# Altium schematic sheet Connectors and PDB.SchDoc: Connectors and PDB
size Letter; DrawnBy: Kyle Hong; SheetNumber: 2; SheetTotal: 2
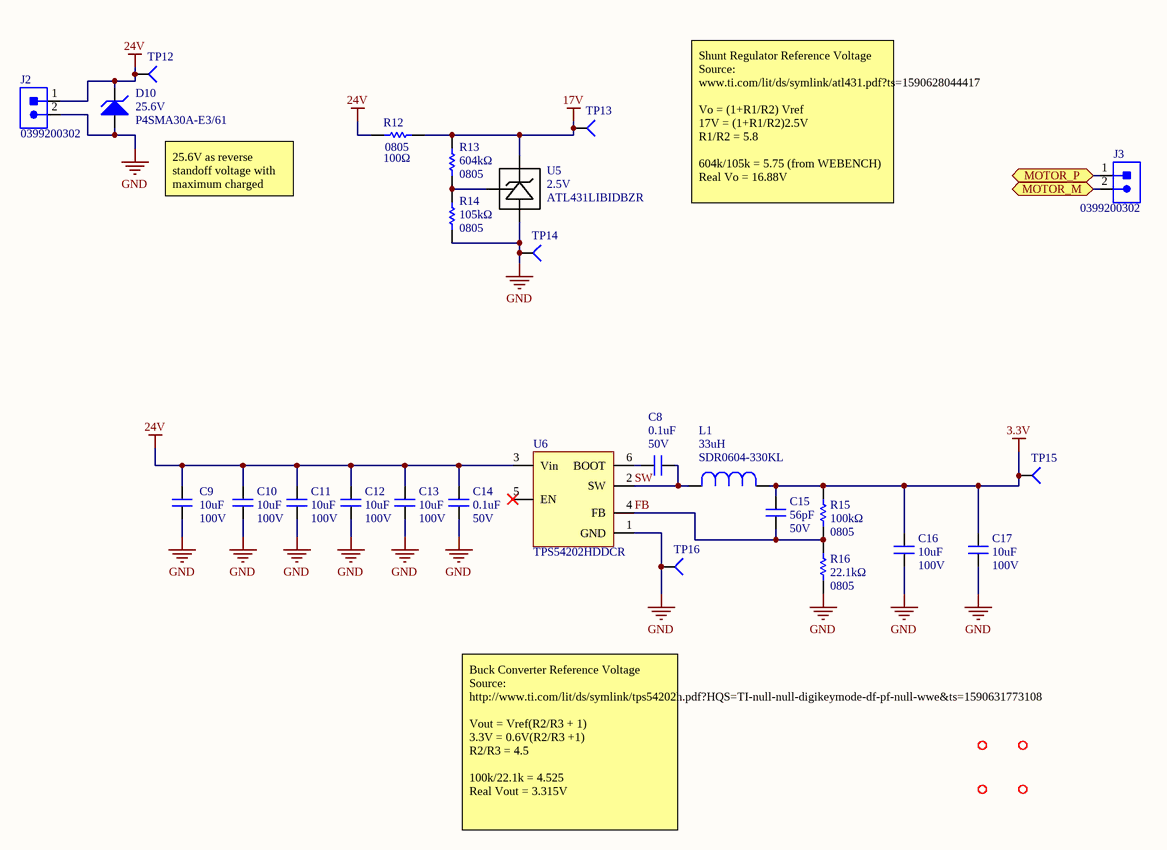
[diagram p0: Connectors and PDB.SchDoc]

## Parts
C8  value 0.1uF  Voltage Rating: 50V  [CAPC2012X140N]  (hidden comment: CAP_0.1uF_50V_0805)
C9  Capacitance: 10uF  Voltage Rating: 100V  [CAPC1210(3225)]  (hidden comment: CAP_10uF_100V_1210)
C10  Capacitance: 10uF  Voltage Rating: 100V  [CAPC1210(3225)]  (hidden comment: CAP_10uF_100V_1210)
C11  Capacitance: 10uF  Voltage Rating: 100V  [CAPC1210(3225)]  (hidden comment: CAP_10uF_100V_1210)
C12  Voltage Rating: 100V  Capacitance: 10uF  [CAPC1210(3225)]  (hidden comment: CAP_10uF_100V_1210)
C13  Voltage Rating: 100V  Capacitance: 10uF  [CAPC1210(3225)]  (hidden comment: CAP_10uF_100V_1210)
C14  value 0.1uF  Voltage Rating: 50V  [CAPC2012X140N]  (hidden comment: CAP_0.1uF_50V_0805)
C15  Voltage Rating: 50V  Capacitance: 56pF  [CAP 0805_2012]  (hidden comment: CAP_56pF_50V_0805)
C16  Capacitance: 10uF  Voltage Rating: 100V  [CAPC1210(3225)]  (hidden comment: CAP_10uF_100V_1210)
C17  Capacitance: 10uF  Voltage Rating: 100V  [CAPC1210(3225)]  (hidden comment: CAP_10uF_100V_1210)
D10  Reverse Standoff Voltage: 25.6V  [DO-214AC_UNI]  (hidden comment: P4SMA30A-E3/61)
J2  Manufacturer Part Number 1: 0399200302  [MOLEX-0399200302]  (hidden comment: SCREW_TERM_115A)
J3  Manufacturer Part Number 1: 0399200302  [MOLEX-0399200302]  (hidden comment: SCREW_TERM_115A)
L1  Manufacturer Part Number 1: SDR0604-330KL  Inductance: 33uH  [IND_BOURNS_SDR0604]  (hidden comment: IND_33uH_880mA)
MH1  MOUNTING_HOLES  [MOUNTING_HOLE]  (value not drawn)
MH2  MOUNTING_HOLES  [MOUNTING_HOLE]  (value not drawn)
MH3  MOUNTING_HOLES  [MOUNTING_HOLE]  (value not drawn)
MH4  MOUNTING_HOLES  [MOUNTING_HOLE]  (value not drawn)
R12  value 100Ω  Case Code (Imperial): 0805  [RESC2012X60N]  (hidden comment: RES_100Ω_0805)
R13  Resistance: 604kΩ  Case/Package: 0805  [RESC2012X60N]  (hidden comment: RES_604kΩ_0805)
R14  Resistance: 105kΩ  Case Code (Imperial): 0805  [RESC2012X60N]  (hidden comment: RES_105kΩ_0805)
R15  Resistance: 100kΩ  Case/Package: 0805  [RESC2012X60N]  (hidden comment: RES_100kΩ_0805)
R16  Case Code (Imperial): 0805  Resistance: 22.1kΩ  [RESC2012X60N]  (hidden comment: RES_22.1kΩ_0805)
TP12  TESTPOINT_SMD  [TESTPOINT]  (value not drawn)
TP13  TESTPOINT_SMD  [TESTPOINT]  (value not drawn)
TP14  TESTPOINT_SMD  [TESTPOINT]  (value not drawn)
TP15  TESTPOINT_SMD  [TESTPOINT]  (value not drawn)
TP16  TESTPOINT_SMD  [TESTPOINT]  (value not drawn)
U5  Reference Voltage: 2.5V  [SOT23-3]  (hidden comment: ATL431LIBIDBZR)
U6  TPS54202HDDCR  [SOT23-6]

## Ports
MOTOR_M (bidir), MOTOR_P (bidir)

## Nets
3.3V: C15.2 C16.2 C17.2 L1.1 R15.2 TP15.1(=value)
17V: R12.2 R13.2 TP13.1(=value) U5.1(CATHODE)
24V: C9.2 C10.2 C11.2 C12.2 C13.2 C14.2 D10.2 J2.1 R12.1 TP12.1(=value) U6.3(Vin)
GND: C9.1 C10.1 C11.1 C12.1 C13.1 C14.1 C16.1 C17.1 D10.1 J2.2 R14.1 R16.1 TP14.1(=value) TP16.1(=value) U5.3(ANODE) U6.1(GND)
FB: C15.1 R15.1 R16.2 U6.4(FB)
MOTOR_M: J3.2 ; port MOTOR_M
MOTOR_P: J3.1 ; port MOTOR_P
SW: C8.2 L1.2 U6.2(SW)
NetC8_1: C8.1 U6.6(BOOT)
NetR13_1: R13.1 R14.2 U5.2(REF)

Not connected (* = marked no-connect by the designer): U6 5(EN)*

## Notes on the sheet
- 25.6V as reverse standoff voltage with maximum charged condition in mind
- Shunt Regulator Reference Voltage
  Source: www.ti.com/lit/ds/symlink/atl431.pdf?ts=1590628044417
  Vo = (1+R1/R2) Vref
  17V = (1+R1/R2)2.5V
  R1/R2 = 5.8
  604k/105k = 5.75 (from WEBENCH)
  Real Vo = 16.88V
- Buck Converter Reference Voltage
  Source: http://www.ti.com/lit/ds/symlink/tps54202h.pdf?HQS=TI-null-null-digikeymode-df-pf-null-wwe&ts=1590631773108
  Vout = Vref(R2/R3 + 1)
  3.3V = 0.6V(R2/R3 +1)
  R2/R3 = 4.5
  100k/22.1k = 4.525
  Real Vout = 3.315V
- Title
- Size:
- Date:
- Letter
- Drawn By:
- Sheet
- of
- File:

## Library data of the parts
C8 C14 = CAP_0.1uF_50V_0805: CAP CER 0.1UF 50V X7R 0805; Manufacturer 1: Murata Electronics; Manufacturer Part Number 1: GCD21BR71H104KA01L; Capacitance: 100nF; Tolerance: 10%; Mount: Surface Mount; Case/Package: 0805; Case Code (Metric): 2012; Case Code (Imperial): 0805; Min Operating Temperature: -55°C; Max Operating Temperature: 125°C; Dielectric: X7R; Termination: SMD/SMT; Length: 2mm; Height: 1.25mm; Width: 0.049inch; Thickness: 0.049inch; Depth: 1.25mm; Ratings: AEC-Q200; ComponentLink1URL: https://datasheet.ciiva.com/29537/c03e-29537701.pdf?src-supplier=Digi-Key; ComponentLink1Description: https://datasheet.ciiva.com/29537/c03e-29537701.pdf?src-supplier=Digi-Key; Supplier 1: Digi-Key; Supplier Part Number 1: 490-11955-1-ND
C9-C13 C16 C17 = CAP_10uF_100V_1210: CAP CER 10uF 100V X7S 10% 1210; Manufacturer 1: Murata; Manufacturer Part Number 1: GRM32EC72A106KE05L; Supplier 1: Digi-Key; RoHS: No; Category: Ceramic Capacitors; Stock 1: 5650; Pricing 1: 1=1.51000, 10=1.19500, 100=0.89660, 500=0.67740 (USD); Mount: Surface Mount; Case/Package: 1210; Case Code (Imperial): 1210; Case Code (Metric): 3225; Min Operating Temperature: -55°C; Max Operating Temperature: 125°C; Packaging: Tape and Reel; Tolerance: 10%; ComponentLink1URL: https://psearch.en.murata.com:443/capacitor/product/GRM32EC72A106KE05%23.pdf?src-supplier=IHS+Markit; ComponentLink1Description: https://psearch.en.murata.com:443/capacitor/product/GRM32EC72A106KE05%23.pdf?src-supplier=IHS+Markit; ComponentLink2URL: http://search.murata.co.jp/Ceramy/image/img/A01X/G101/ENG/GRM32EC72A106KE05-01.pdf?src-supplier=Digi-Key; ComponentLink2Description: http://search.murata.co.jp/Ceramy/image/img/A01X/G101/ENG/GRM32EC72A106KE05-01.pdf?src-supplier=Digi-Key; Supplier Part Number 1: 490-16266-1-ND
C15 = CAP_56pF_50V_0805: CAP CER 56PF 50V C0G/NP0; Manufacturer 1: Yageo; Manufacturer Part Number 1: CC0805FRNPO9BN560; Dielectric: C0G; Tolerance: 1%; Supplier 1: Digi-Key; RoHS: Yes; Category: Ceramic Capacitors; Stock 1: 3302; Pricing 1: 1=0.28000, 10=0.19000, 100=0.10740, 500=0.07582, 1000=0.06634 (USD); Mount: Surface Mount; Case/Package: 0805; Weight: 0.000194oz; Case Code (Metric): 2012; Case Code (Imperial): 0805; Min Operating Temperature: -55°C; Max Operating Temperature: 125°C; Termination: SMD/SMT; Composition: Ceramic; Packaging: Tape and Reel; Voltage Rating (DC): 50V; Length: 2mm; Height: 0.6mm; Depth: 1.25mm; Width: 0.049inch; Thickness: 0.028inch; Radiation Hardening: No; ComponentLink1URL: https://datasheet.ciiva.com:443/pdfs/VipMasterIC/IC/YAGO/YAGO-S-A0009251638/YAGO-S-A0009251638-1.pdf?src-supplier=IHS+Markit; ComponentLink1Description: https://datasheet.ciiva.com:443/pdfs/VipMasterIC/IC/YAGO/YAGO-S-A0009251638/YAGO-S-A0009251638-1.pdf?src-supplier=IHS+Markit; ComponentLink2URL: https://datasheet.ciiva.com/26918/getdatasheetpartid-251796-26918325.pdf?src-supplier=Verical; ComponentLink2Description: https://datasheet.ciiva.com/26918/getdatasheetpartid-251796-26918325.pdf?src-supplier=Verical; ComponentLink3URL: https://datasheet.ciiva.com/11465/upy-gp-np0-16v-to-50v-8-11465142.pdf?src-supplier=Avnet; ComponentLink3Description: https://datasheet.ciiva.com/11465/upy-gp-np0-16v-to-50v-8-11465142.pdf?src-supplier=Avnet; ComponentLink4URL: https://datasheet.ciiva.com/17436/upy-gp-np0-16v-to-50v-8-17436825.pdf?src-supplier=Avnet+Europe; ComponentLink4Description: https://datasheet.ciiva.com/17436/upy-gp-np0-16v-to-50v-8-17436825.pdf?src-supplier=Avnet+Europe; Supplier Part Number 1: 311-4179-1-ND
D10 = P4SMA30A-E3/61: TVS DIODE, 400W, 25.6V, UNI, DO-214AC; Manufacturer 1: Vishay Semiconductors; Element Configuration: Single; Leakage Current: 1uA; Direction: Unidirectional; Reverse Breakdown Voltage: 28.5V; Max Surge Current: 40A; Number of Unidirectional Channels: 1; Clamping Voltage: 41.4V; Power Line Protection: No; Test Current: 1mA; Peak Pulse Current: 9.7A; Supplier 1: Digi-Key; RoHS: Yes; Category: TVS Diodes; Stock 1: 1849; Pricing 1: 1=0.35000, 10=0.28400, 25=0.26000, 100=0.16340, 250=0.16152, 500=0.15126 (USD); Mount: Surface Mount; Case/Package: SMA; Number of Pins: 2; Min Operating Temperature: -65°C; Max Operating Temperature: 150°C; Max Power Dissipation: 400W; Composition: Zener; Packaging: Tape and Reel; Package Quantity: 1800; Operating Supply Voltage: 25.6V; Polarity: Unidirectional; Min Breakdown Voltage: 28.5V; Peak Pulse Power: 400W; Breakdown Voltage: 28.5V; Number of Channels: 1; Max Reverse Leakage Current: 1uA; Number of Elements: 1; ComponentLink1URL: https://datasheet.ciiva.com:443/pdfs/VipMasterIC/IC/VISH/VISH-S-A0008073361/VISH-S-A0008073361-1.pdf?src-supplier=IHS+Markit; ComponentLink1Description: https://datasheet.ciiva.com:443/pdfs/VipMasterIC/IC/VISH/VISH-S-A0008073361/VISH-S-A0008073361-1.pdf?src-supplier=IHS+Markit; ComponentLink2URL: https://datasheet.ciiva.com/343/p4sma-343073.pdf?src-supplier=Digi-Key; ComponentLink2Description: https://datasheet.ciiva.com/343/p4sma-343073.pdf?src-supplier=Digi-Key; Supplier Part Number 1: P4SMA30A-E3/61GICT-ND; Manufacturer Part Number 1: P4SMA30A-E3/61
J2 J3 = SCREW_TERM_115A: CONN TERM BLOCK 2POS 15MM 1-8AWG; Manufacturer 1: Molex; Plating: Brass,Bronze,Tin; Number of Levels: 1; Number of Positions Per Level: 2; Current: 115A; Voltage: 600V; Pitch: 0.591inch; Wire Gauge (Max): 8AWG; Wire Gauge (Min): 1AWG; Supplier 1: Digi-Key; Supplier Part Number 1: WM20114-ND; RoHS: Yes; Category: Terminal Blocks; Stock 2: 268; Pricing 2: 1=9.66000, 10=8.27400, 25=7.89600, 50=7.09800, 100=6.72000, 250=6.09000, 500=5.67000, 1000=5.35500, 5000=5.04000 (USD); Mount: Through Hole; Housing Material: Polybutylene; Contact Material: Copper; Color: Black; Contact Plating: Copper,Tin,Bright; Housing Color: Black; Min Operating Temperature: -40°C; Max Operating Temperature: 130°C; Termination: Solder; Packaging: Bulk; Number of Rows: 1; Orientation: Straight; Number of Circuits: 2; Number of Contacts: 2; Max Supply Voltage (AC): 600V; Max Voltage Rating (AC): 600V; Length: 32mm; Depth: 20.32mm; Radiation Hardening: No; ComponentLink1URL: https://datasheet.ciiva.com/6751/399200305-sd-6751818.pdf?src-supplier=Digi-Key; ComponentLink1Description: https://datasheet.ciiva.com/6751/399200305-sd-6751818.pdf?src-supplier=Digi-Key
L1 = IND_33uH_880mA: IND, 33uH, 10%, 1 Element, Ferrite-Core, SMD; Manufacturer 1: Bourns; Max DC Current: 880mA; DC Resistance (DCR): 250mR; Test Frequency: 1kHz; Q Factor: 24; Self Resonant Frequency: 13MHz; Saturation Current: 1.1A; Shielding: Unshielded; Supplier 1: Digi-Key; RoHS: Yes; Category: Fixed Inductors; Stock 1: 4659; Pricing 1: 1=0.60000, 10=0.52300, 100=0.37380 (USD); Mount: Surface Mount; Case/Package: Nonstandard; Number of Pins: 2; Core Material: Ferrite; Min Operating Temperature: -40°C; Max Operating Temperature: 125°C; Tolerance: 10%; Termination: SMD/SMT; Composition: Wirewound; RMS Current (Irms): 880mA; DC Current: 880mA; Military Standard: Not; Resistance: 250MR; Inductance Tolerance: 10%; Packaging: Tape and Reel; Package Quantity: 400; Current Rating: 880mA; Diameter: 5.8mm; Length: 0.228inch; Height: 4.8mm; Height - Seated (Max): 0.189inch; Width: 0.228inch; Radiation Hardening: No; REACH SVHC: No SVHC; ComponentLink1URL: https://datasheet.ciiva.com:443/pdfs/VipMasterIC/IC/BOUR/BOUR-S-A0006604757/BOUR-S-A0006604757-1.pdf?src-supplier=IHS+Markit; ComponentLink1Description: https://datasheet.ciiva.com:443/pdfs/VipMasterIC/IC/BOUR/BOUR-S-A0006604757/BOUR-S-A0006604757-1.pdf?src-supplier=IHS+Markit; ComponentLink2URL: https://datasheet.ciiva.com/11802/0900766b80f2b58d-11802553.pdf?src-supplier=RSComponents; ComponentLink2Description: https://datasheet.ciiva.com/11802/0900766b80f2b58d-11802553.pdf?src-supplier=RSComponents; ComponentLink3URL: https://datasheet.ciiva.com/8516/sdr0604-8516774.pdf?src-supplier=Avnet; ComponentLink3Description: https://datasheet.ciiva.com/8516/sdr0604-8516774.pdf?src-supplier=Avnet; ComponentLink4URL: https://datasheet.ciiva.com/22697/1635216-22697302.pdf?src-supplier=Element14; ComponentLink4Description: https://datasheet.ciiva.com/22697/1635216-22697302.pdf?src-supplier=Element14; ComponentLink5URL: https://datasheet.ciiva.com/6689/sdr0604-6689448.pdf?src-supplier=Digi-Key; ComponentLink5Description: https://datasheet.ciiva.com/6689/sdr0604-6689448.pdf?src-supplier=Digi-Key; ComponentLink6URL: https://datasheet.ciiva.com/7838/1635216-7838921.pdf?src-supplier=Element14; ComponentLink6Description: https://datasheet.ciiva.com/7838/1635216-7838921.pdf?src-supplier=Element14; ComponentLink7URL: https://datasheet.ciiva.com/6689/sdr0604-6689450.pdf?src-supplier=Digi-Key; ComponentLink7Description: https://datasheet.ciiva.com/6689/sdr0604-6689450.pdf?src-supplier=Digi-Key; ComponentLink8URL: https://datasheet.ciiva.com/8515/sdr0604-8515983.pdf?src-supplier=Avnet; ComponentLink8Description: https://datasheet.ciiva.com/8515/sdr0604-8515983.pdf?src-supplier=Avnet; Supplier Part Number 1: SDR0604-330KLCT-ND
MH1-MH4 = MOUNTING_HOLES: 6cm x 6cm
R12 = RES_100Ω_0805: RES SMD 100 OHM 1% 1/8W 0805; Manufacturer 1: Yageo; Manufacturer Part Number 1: RC0805FR-07100RL; Power Rating: 125mW; Supplier 1: Digi-Key; Mount: Surface Mount; Case Code (Metric): 2012; Supplier Part Number 1: 311-100CRCT-ND
R13 = RES_604kΩ_0805: RES SMD 604K OHM 0.1% 1/4W 0805; Manufacturer 1: Panasonic; Manufacturer Part Number 1: ERJ-PB6B6043V; Max Power Dissipation: 250mW; Temperature Coefficient: 50ppm/°C; Supplier 1: Digi-Key; RoHS: Yes; Category: Chip SMD Resistors; Stock 1: 1993; Pricing 1: 1=0.36000, 10=0.30600, 25=0.22280, 50=0.16140, 100=0.11970, 250=0.09184, 500=0.07236, 1000=0.05009 (USD); Case Code (Imperial): 0805; Case Code (Metric): 2012; Min Operating Temperature: -55°C; Max Operating Temperature: 155°C; Features: Automotive AEC-Q200; Tolerance: 0.1%; Packaging: Tape and Reel; Composition: Thick Film; Number of Terminations: 2; Length: 0.079inch; Width: 0.049inch; Height - Seated (Max): 0.028inch; ComponentLink1URL: https://industrial.panasonic.com/sa/system/files/data/download/catalog/id_fixed-resistors_e_2.pdf?src-supplier=Digi-Key; ComponentLink1Description: https://industrial.panasonic.com/sa/system/files/data/download/catalog/id_fixed-resistors_e_2.pdf?src-supplier=Digi-Key; Supplier Part Number 1: P20911CT-ND
R14 = RES_105kΩ_0805: RES SMD 105K OHM 0.1% 1/8W 0805; Manufacturer 1: Panasonic; Manufacturer Part Number 1: ERA-6AEB1053V; Temperature Coefficient: 25ppm/°C; Max Power Dissipation: 125mW; Voltage Rating: 100V; Supplier 1: Digi-Key; RoHS: Yes; Category: Chip SMD Resistors; Stock 1: 6757; Pricing 1: 1=0.34000, 10=0.28800, 100=0.11260, 1000=0.04712, 2500=0.04320 (USD); Mount: Surface Mount; Case/Package: 0805; Number of Pins: 2; Contact Plating: Tin; Case Code (Metric): 2012; Min Operating Temperature: -55°C; Max Operating Temperature: 155°C; Tolerance: 0.1%; Composition: Metal Film,Thin Film; Power Rating: 125mW; Packaging: Tape and Reel; Package Quantity: 5000; Voltage Rating (DC): 100V; Number of Terminations: 2; Termination: Solder; Length: 2mm; Height: 0.5mm; Width: 1.25mm; Depth: 1.25mm; Radiation Hardening: No; Lead Free: Lead Free; ComponentLink1URL: https://datasheet.ciiva.com/11810/0900766b80eb1d8c-11810401.pdf?src-supplier=RSComponents; ComponentLink1Description: https://datasheet.ciiva.com/11810/0900766b80eb1d8c-11810401.pdf?src-supplier=RSComponents; ComponentLink2URL: https://datasheet.ciiva.com/41450/001181353-da-01-en-widerstand-era-0805-105k-0-1-5000st-41450513.pdf?src-supplier=Conrad; ComponentLink2Description: https://datasheet.ciiva.com/41450/001181353-da-01-en-widerstand-era-0805-105k-0-1-5000st-41450513.pdf?src-supplier=Conrad; ComponentLink3URL: https://datasheet.ciiva.com/5950/485442-5950968.pdf?src-supplier=Farnell; ComponentLink3Description: https://datasheet.ciiva.com/5950/485442-5950968.pdf?src-supplier=Farnell; ComponentLink4URL: https://datasheet.ciiva.com/5950/485442-5950970.pdf?src-supplier=Farnell; ComponentLink4Description: https://datasheet.ciiva.com/5950/485442-5950970.pdf?src-supplier=Farnell; ComponentLink5URL: https://datasheet.ciiva.com/17207/aoa0000ce26-17207943.pdf?src-supplier=Avnet+Europe; ComponentLink5Description: https://datasheet.ciiva.com/17207/aoa0000ce26-17207943.pdf?src-supplier=Avnet+Europe; ComponentLink6URL: https://datasheet.ciiva.com/7853/485442-7853533.pdf?src-supplier=Element14; ComponentLink6Description: https://datasheet.ciiva.com/7853/485442-7853533.pdf?src-supplier=Element14; ComponentLink7URL: https://datasheet.ciiva.com/5950/485442-5950967.pdf?src-supplier=Farnell; ComponentLink7Description: https://datasheet.ciiva.com/5950/485442-5950967.pdf?src-supplier=Farnell; ComponentLink8URL: https://datasheet.ciiva.com/5950/485442-5950969.pdf?src-supplier=Farnell; ComponentLink8Description: https://datasheet.ciiva.com/5950/485442-5950969.pdf?src-supplier=Farnell; ComponentLink9URL: https://datasheet.ciiva.com/7853/485442-7853532.pdf?src-supplier=Element14; ComponentLink9Description: https://datasheet.ciiva.com/7853/485442-7853532.pdf?src-supplier=Element14; Supplier Part Number 1: P105KDACT-ND
R15 = RES_100kΩ_0805: RES SMD 100K OHM 0.5% 1/8W 0805; Manufacturer 1: Panasonic; Manufacturer Part Number 1: ERA-6AED104V; Power Rating: 125mW; Temperature Coefficient: 25ppm/°C; Voltage Rating: 200V; Supplier 1: Digi-Key; RoHS: Yes; Category: Chip SMD Resistors; Stock 1: 16167; Pricing 1: 1=0.11000, 10=0.10300, 25=0.07120, 50=0.05540, 100=0.03960, 250=0.03088, 500=0.02456, 1000=0.01742 (USD); Mount: Surface Mount; Case Code (Metric): 2012; Case Code (Imperial): 0805; Contact Plating: Tin; Min Operating Temperature: -55°C; Max Operating Temperature: 155°C; Composition: Thin Film; Termination: SMD/SMT; Military Standard: Not; Packaging: Tape and Reel; Package Quantity: 5000; Length: 2mm; Height: 0.5mm; Depth: 1.25mm; Width: 1.25mm; Lead Free: Lead Free; ComponentLink1URL: https://datasheet.ciiva.com:443/pdfs/VipMasterIC/IC/PANA/PANA-S-A0009459258/PANA-S-A0009459258-1.pdf?src-supplier=IHS+Markit; ComponentLink1Description: https://datasheet.ciiva.com:443/pdfs/VipMasterIC/IC/PANA/PANA-S-A0009459258/PANA-S-A0009459258-1.pdf?src-supplier=IHS+Markit; ComponentLink2URL: https://datasheet.ciiva.com/9186/aoa0000ce26-9186773.pdf?src-supplier=Avnet; ComponentLink2Description: https://datasheet.ciiva.com/9186/aoa0000ce26-9186773.pdf?src-supplier=Avnet; Supplier Part Number 1: P123795CT-ND; Tolerance: 0.5%
R16 = RES_22.1kΩ_0805: RES SMD 22.1K OHM 1% 1/8W 0805; Manufacturer 1: Vishay Dale; Manufacturer Part Number 1: CRCW080522K1FKEA; Power Rating: 125mW; Supplier 1: Digi-Key; Case Code (Metric): 2012; Min Operating Temperature: -55°C; Max Operating Temperature: 155°C; Tolerance: 1%; Termination: SMD/SMT; Supplier Part Number 1: 541-22.1KCCT-ND
U5 = ATL431LIBIDBZR: Three Terminal Voltage Reference, 1 Output, 2.5V, Trim/Adjustable, PDSO3; Manufacturer 1: Texas Instruments; Supplier 1: Digi-Key; RoHS: No; Stock 1: 2706; Pricing 1: 1=0.48000, 10=0.41300, 25=0.38520, 100=0.28600, 250=0.24200, 500=0.23100, 1000=0.17050 (USD); ComponentLink1URL: https://www.ti.com:443/lit/ds/symlink/atl431li.pdf?src-supplier=IHS+Markit; ComponentLink1Description: https://www.ti.com:443/lit/ds/symlink/atl431li.pdf?src-supplier=IHS+Markit; Supplier Part Number 1: 296-53203-1-ND; Manufacturer Part Number 1: ATL431LIBIDBZR
U6 = TPS54202HDDCR: Switching Regulator, Current-mode, 3.9A, 500kHz Switching Freq-Max, PDSO6; Manufacturer 1: Texas Instruments; Output Type: Adjustable; Output Configuration: Positive; Number of Outputs: 1; Min Input Voltage: 4.5V; Max Input Voltage: 28V; Min Output Voltage: 596mV; Output Current: 2A; Synchronous Rectifier: Yes; Quiescent Current: 40uA; Supplier 1: Digi-Key; RoHS: No; Category: Voltage Regulators - Switching; Stock 1: 8470; Pricing 1: 1=1.45000, 10=1.29800, 25=1.23200, 100=0.94600, 250=0.83600, 500=0.79200, 1000=0.61600 (USD); Mount: Surface Mount; Case/Package: SOT-23-6; Min Operating Temperature: -40°C; Max Operating Temperature: 125°C; Packaging: Tape and Reel; Max Output Voltage: 28V; Switching Frequency: 500kHz; Lead Free: Lead Free; ComponentLink1URL: https://www.ti.com:443/lit/ds/symlink/tps54202h.pdf?src-supplier=IHS+Markit; ComponentLink1Description: https://www.ti.com:443/lit/ds/symlink/tps54202h.pdf?src-supplier=IHS+Markit; ComponentLink2URL: http://www.ti.com/lit/ds/symlink/tps54202h.pdf?src-supplier=Digi-Key; ComponentLink2Description: http://www.ti.com/lit/ds/symlink/tps54202h.pdf?src-supplier=Digi-Key; Supplier Part Number 1: 296-44396-1-ND; Manufacturer Part Number 1: TPS54202HDDCR
TP12-TP16 = TESTPOINT_SMD: Part Number (MPN): *